# EAGLE design tap (EAGLE 6.2)
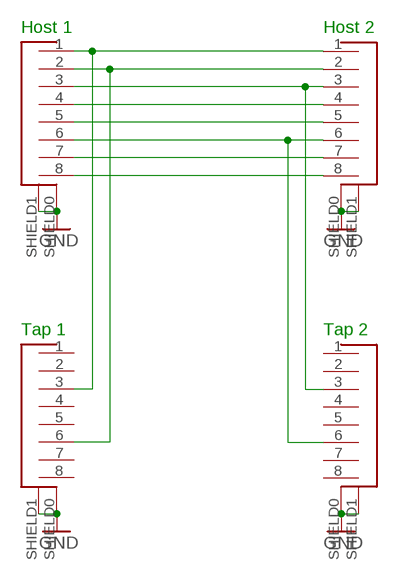
[diagram p0: schematic, sheet 1]

## Parts
HOST1  451000  [RJ45]
HOST2  451000  [RJ45]
TAP1  451000  [RJ45]
TAP2  451000  [RJ45]

## Nets
GND: HOST1.SHIELD0 HOST1.SHIELD1 HOST2.SHIELD0 HOST2.SHIELD1 TAP1.SHIELD0 TAP1.SHIELD1 TAP2.SHIELD0 TAP2.SHIELD1
N$1: HOST1.1 HOST2.1 TAP1.3
N$2: HOST1.2 HOST2.2 TAP1.6
N$3: HOST1.3 HOST2.3 TAP2.3
N$4: HOST1.4 HOST2.4
N$5: HOST1.5 HOST2.5
N$6: HOST1.6 HOST2.6 TAP2.6
N$7: HOST1.7 HOST2.7
N$8: HOST1.8 HOST2.8
Unconnected: TAP1.1 TAP1.2 TAP1.4 TAP1.5 TAP1.7 TAP1.8 TAP2.1 TAP2.2 TAP2.4 TAP2.5 TAP2.7 TAP2.8

## Notes on the sheet
- Host 1 | Host 2
- Tap 1 | Tap 2

## Library data of the parts
HOST1 HOST2 TAP1 TAP2 = pollin:451000

## Board
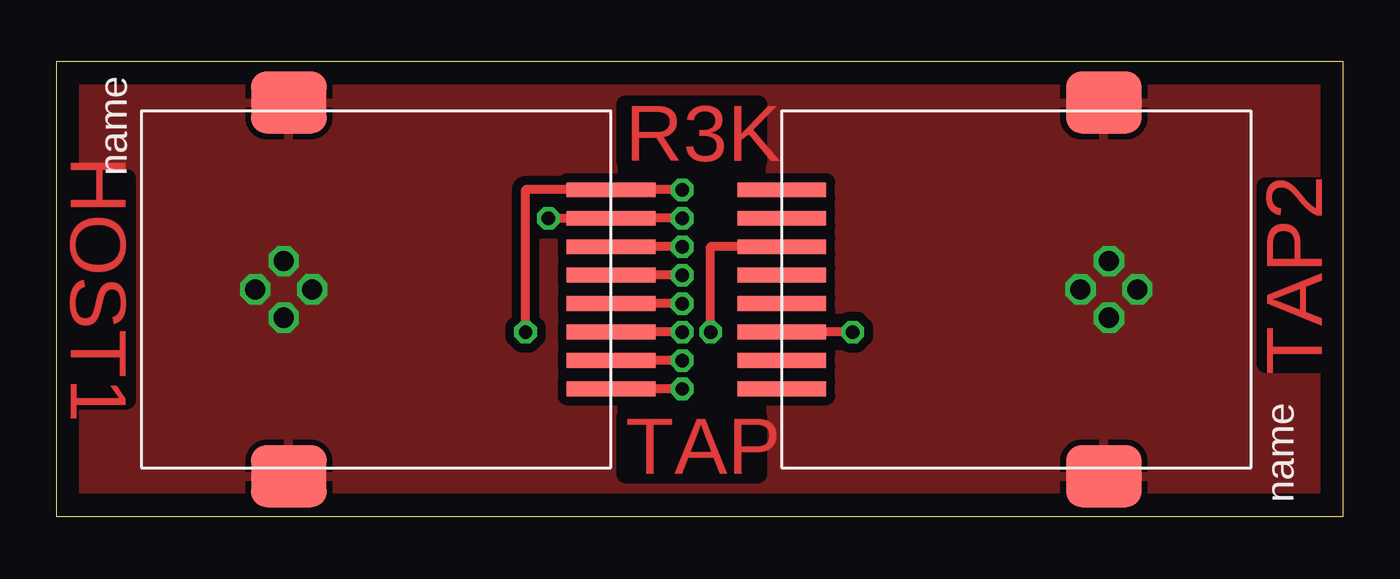
[diagram p1: board, top side]
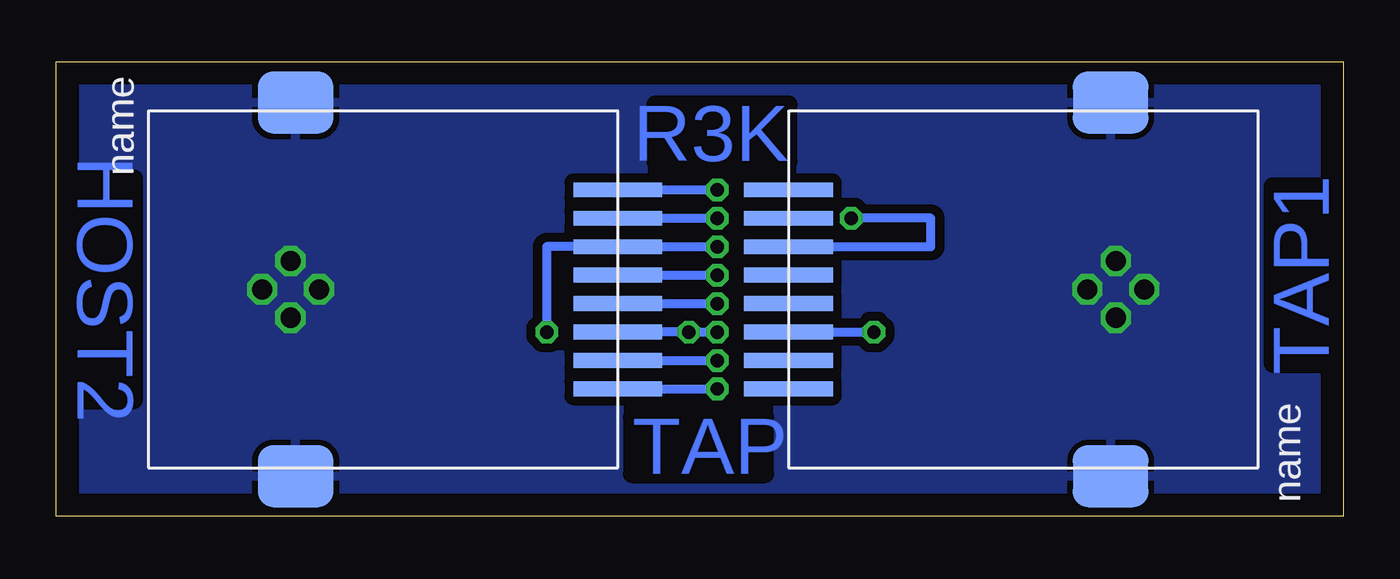
[diagram p2: board, bottom side, seen from below]

Size 57.45 x 20.3 mm. Coordinates in mm from the lower left corner, seen from the top.
Outline: 0,20.3 0,0 57.45,0 57.45,20.3 0,20.3
Copper layers (1*16): Top 0.035mm / dielectric 1.5mm / Bottom 0.035mm
Design rules: minimum track width 10mil, minimum drill 24mil, track to track 16mil, track to pad 16mil, pad to pad 16mil, via to via 16mil, smd to smd 16mil, copper to edge 40mil, drill to drill 8mil, minimum pad ring 10mil, minimum via ring 8mil, stop-mask expansion 4mil, vias tented up to drill 0mil, thermal gap 10mil

### Footprints (pad centres in the part's own frame; a part is rotated, then mirrored left to right if it is on the bottom)
RJ45 = smd 0.66 x 3.962: 1 -4.445,4.445; 2 -3.175,4.445; 3 -1.905,4.445; 4 -0.635,4.445; 5 0.635,4.445; 6 1.905,4.445; 7 3.175,4.445; 8 4.445,4.445 | smd 2.769 x 3.378: SHIELD0 -8.344,-9.931; SHIELD1 8.344,-9.931

### Placement (x,y rotation side)
HOST1  20.32,10.14 270 top
HOST2  36.83,10.14 270 bottom
TAP1  20.32,10.14 90 bottom
TAP2  36.83,10.14 90 top

### Tracks (layer width: path | path; a pad name or v marks a point on that pad's centre or on a via)
GND  (via drill 0.9)
  other vias: 11.43,10.14 8.89,10.14 10.16,11.41 10.16,8.87 48.26,10.14 45.72,10.14 46.99,11.41 46.99,8.87
  pour Top: 57.78,20.93 57.78,-0.66 -0.64,-0.66 -0.64,20.93
  pour Bottom: 57.78,20.93 57.78,-0.66 -0.64,-0.66 -0.64,20.93
N$1  (via drill 0.6)
  Top 0.406: v27.94,14.59 HOST1.1 20.95,14.59 v20.95,8.24
  Bottom 0.406: HOST2.1 v27.94,14.59 | TAP1.3 v20.95,8.24
N$2  (via drill 0.6)
  Top 0.406: v27.94,13.32 HOST1.2 v21.97,13.32
  Bottom 0.406: HOST2.2 v27.94,13.32 | TAP1.6 18.41,12.04 18.41,13.32 v21.97,13.32
N$3  (via drill 0.6)
  Top 0.406: v27.94,12.04 HOST1.3 | v35.56,8.24 TAP2.3
  Bottom 0.406: v27.94,12.04 HOST2.3 35.56,12.04 v35.56,8.24
N$4  (via drill 0.6)
  Top 0.406: v27.94,10.78 HOST1.4
  Bottom 0.406: HOST2.4 v27.94,10.78
N$5  (via drill 0.6)
  Top 0.406: v27.94,9.51 HOST1.5
  Bottom 0.406: HOST2.5 v27.94,9.51
N$6  (via drill 0.6)
  Top 0.406: v27.94,8.24 HOST1.6 | TAP2.6 29.21,12.04 v29.21,8.24
  Bottom 0.406: v27.94,8.24 v29.21,8.24 HOST2.6
N$7  (via drill 0.6)
  Top 0.406: v27.94,6.97 HOST1.7
  Bottom 0.406: HOST2.7 v27.94,6.97
N$8  (via drill 0.6)
  Top 0.406: v27.94,5.7 HOST1.8
  Bottom 0.406: HOST2.8 v27.94,5.7

### Text on the board
Top: R3K | TAP2 | HOST1 | TAP
Bottom: R3K | TAP1 | HOST2 | TAP